# Altium schematic sheet SDVX.SchDoc
size A4; SheetNumber: 1; SheetTotal: 1
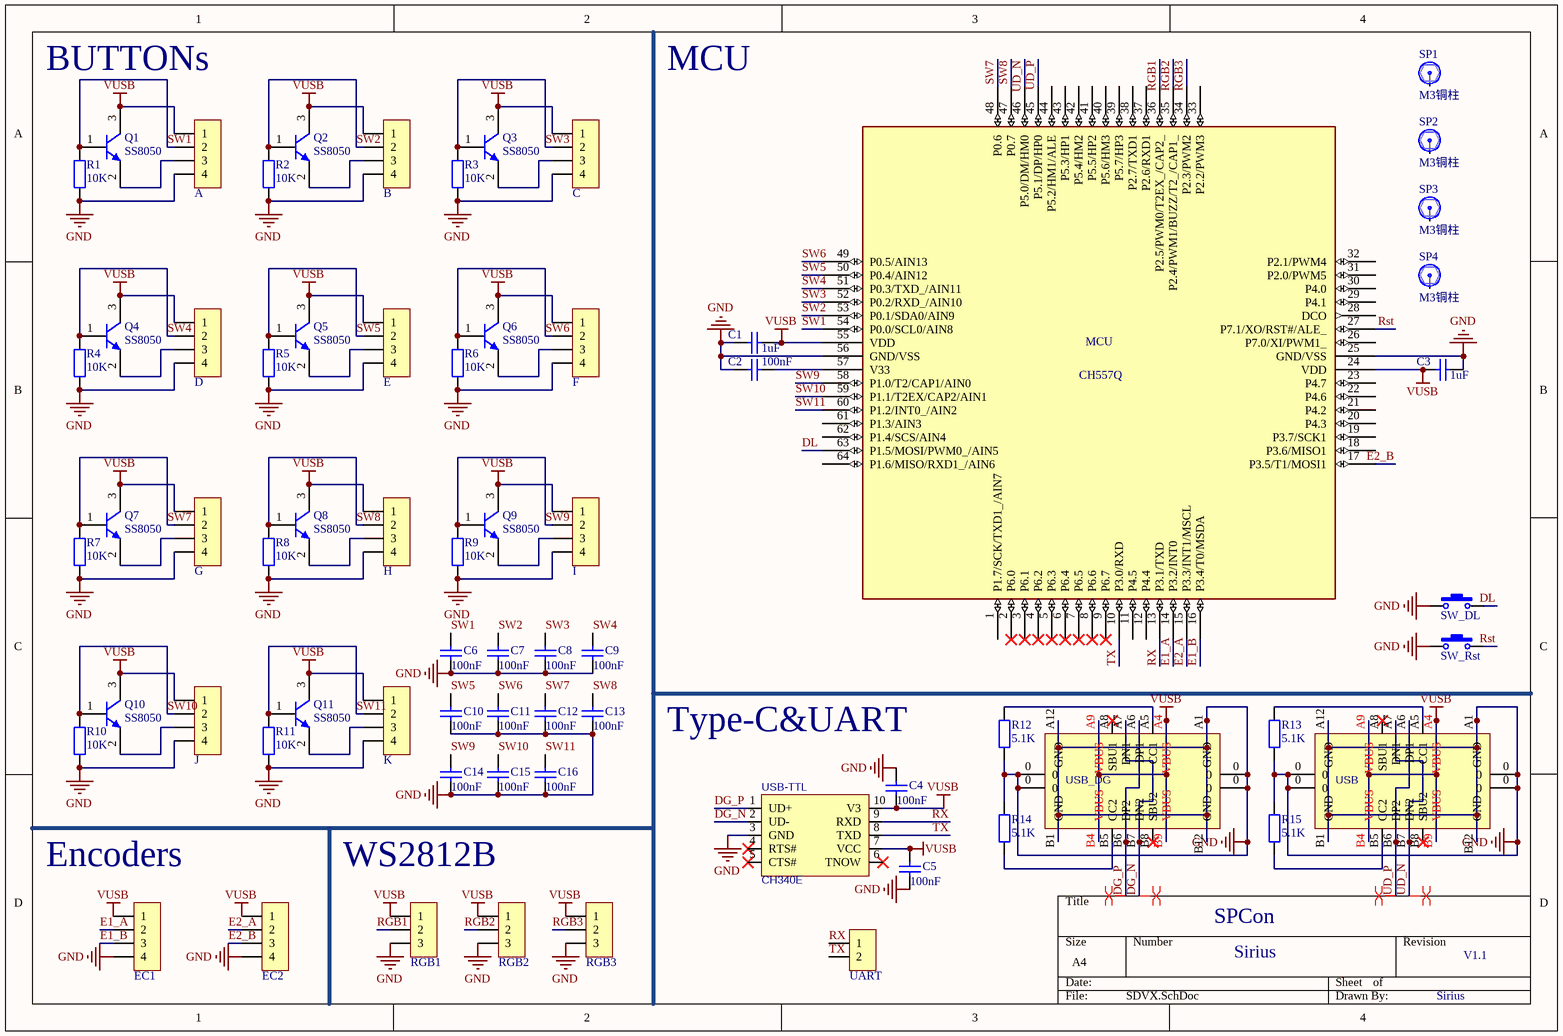
[diagram p0: SDVX.SchDoc]

## Parts
A  HDR-1X4  [XH2.54-WI-4P]  (value not drawn)
B  HDR-1X4  [XH2.54-WI-4P]  (value not drawn)
C  HDR-1X4  [XH2.54-WI-4P]  (value not drawn)
C1  1uF  [C0603_L]
C2  100nF  [C0603_L]
C3  1uF  [C0603_L]
C4  100nF  [C0603_L]
C5  100nF  [C0603_L]
C6  100nF  [C0603_L]
C7  100nF  [C0603_L]
C8  100nF  [C0603_L]
C9  100nF  [C0603_L]
C10  100nF  [C0603_L]
C11  100nF  [C0603_L]
C12  100nF  [C0603_L]
C13  100nF  [C0603_L]
C14  100nF  [C0603_L]
C15  100nF  [C0603_L]
C16  100nF  [C0603_L]
D  HDR-1X4  [XH2.54-WI-4P]  (value not drawn)
E  HDR-1X4  [XH2.54-WI-4P]  (value not drawn)
EC1  HDR-1X4  [XH2.54-WI-4P]  (value not drawn)
EC2  HDR-1X4  [XH2.54-WI-4P]  (value not drawn)
F  HDR-1X4  [XH2.54-WI-4P]  (value not drawn)
G  HDR-1X4  [XH2.54-WI-4P]  (value not drawn)
H  HDR-1X4  [XH2.54-WI-4P]  (value not drawn)
I  HDR-1X4  [XH2.54-WI-4P]  (value not drawn)
J  HDR-1X4  [XH2.54-WI-4P]  (value not drawn)
K  HDR-1X4  [XH2.54-WI-4P]  (value not drawn)
MCU  CH557Q  [LQFP64]
Q1  SS8050  [SOT23-3M]
Q2  SS8050  [SOT23-3M]
Q3  SS8050  [SOT23-3M]
Q4  SS8050  [SOT23-3M]
Q5  SS8050  [SOT23-3M]
Q6  SS8050  [SOT23-3M]
Q7  SS8050  [SOT23-3M]
Q8  SS8050  [SOT23-3M]
Q9  SS8050  [SOT23-3M]
Q10  SS8050  [SOT23-3M]
Q11  SS8050  [SOT23-3M]
R1  10K  [R0603_L]
R2  10K  [R0603_L]
R3  10K  [R0603_L]
R4  10K  [R0603_L]
R5  10K  [R0603_L]
R6  10K  [R0603_L]
R7  10K  [R0603_L]
R8  10K  [R0603_L]
R9  10K  [R0603_L]
R10  10K  [R0603_L]
R11  10K  [R0603_L]
R12  5.1K  [R0603_L]
R13  5.1K  [R0603_L]
R14  5.1K  [R0603_L]
R15  5.1K  [R0603_L]
RGB1  HDR-1X3  [HDR2.54-LI-3P]  (value not drawn)
RGB2  HDR-1X3  [HDR2.54-LI-3P]  (value not drawn)
RGB3  HDR-1X3  [HDR2.54-LI-3P]  (value not drawn)
SP1  M3铜柱  [M3x4_L]
SP2  M3铜柱  [M3x4_L]
SP3  M3铜柱  [M3x4_L]
SP4  M3铜柱  [M3x4_L]
SW_DL  3x6x5  [SW-SMD_L4.7-W3.5-P3.35-EH]  (value not drawn)
SW_Rst  3x6x5  [SW-SMD_L4.7-W3.5-P3.35-EH]  (value not drawn)
UART  HDR-1X2  [HDR2.54-LI-2P]  (value not drawn)
USB  TYPE-C 2.0 -16P  [USB-C-SMD_16P]  (value not drawn)
USB-TTL  CH340E  [MSOP-10]
USB_DG  TYPE-C 2.0 -16P  [USB-C-SMD_16P]  (value not drawn)

## Nets
GND: A.4 B.4 C.4 C1.2 C2.2 C3.1 C4.2 C5.1 C6.1 C7.1 C8.1 C9.1 C10.1 C11.1 C12.1 C13.1 C14.1 C15.1 C16.2 D.4 E.4 EC1.4 EC2.4 F.4 G.4 H.4 I.4 J.4 K.4 MCU.25(GND/VSS) MCU.56(GND/VSS) R1.1 R2.1 R3.1 R4.1 R5.1 R6.1 R7.1 R8.1 R9.1 R10.1 R11.1 R12.1 R13.1 R14.2 R15.2 RGB1.3 RGB2.3 RGB3.3 SW_DL.1 SW_Rst.1 USB.0 USB.A1(GND) USB.A12(GND) USB.B1(GND) USB.B12(GND) USB-TTL.3(GND) USB_DG.0 USB_DG.A1(GND) USB_DG.A12(GND) USB_DG.B1(GND) USB_DG.B12(GND)
VUSB: A.1 B.1 C.1 C1.1 C3.2 C4.1 C5.2 D.1 E.1 EC1.1 EC2.1 F.1 G.1 H.1 I.1 J.1 K.1 MCU.24(VDD) MCU.55(VDD) Q1.3(C) Q2.3(C) Q3.3(C) Q4.3(C) Q5.3(C) Q6.3(C) Q7.3(C) Q8.3(C) Q9.3(C) Q10.3(C) Q11.3(C) RGB1.1 RGB2.1 RGB3.1 USB.A4(VBUS) USB.A9(VBUS) USB.B4(VBUS) USB.B9(VBUS) USB-TTL.7(VCC) USB-TTL.10(V3) USB_DG.A4(VBUS) USB_DG.A9(VBUS) USB_DG.B4(VBUS) USB_DG.B9(VBUS)
DG_N: USB-TTL.2(UD-) USB_DG.A7(DN1) USB_DG.B7(DN2)
DG_P: USB-TTL.1(UD+) USB_DG.A6(DP1) USB_DG.B6(DP2)
DL: MCU.63(P1.5/MOSI/PWM0_/AIN5) SW_DL.2
E1_A: EC1.2 MCU.14(P3.2/INT0)
E1_B: EC1.3 MCU.16(P3.4/T0/MSDA)
E2_A: EC2.2 MCU.15(P3.3/INT1/MSCL)
E2_B: EC2.3 MCU.17(P3.5/T1/MOSI1)
RGB1: MCU.36(P2.5/PWM0/T2EX_/CAP2_) RGB1.2
RGB2: MCU.35(P2.4/PWM1/BUZZ/T2_/CAP1_) RGB2.2
RGB3: MCU.34(P2.3/PWM2) RGB3.2
Rst: MCU.27(P7.1/XO/RST#/ALE_) SW_Rst.2
RX: MCU.13(P3.1/TXD) UART.1 USB-TTL.9(RXD)
SW1: A.2 C6.2 MCU.54(P0.0/SCL0/AIN8) Q1.1(B) R1.2
SW2: B.2 C7.2 MCU.53(P0.1/SDA0/AIN9) Q2.1(B) R2.2
SW3: C.2 C8.2 MCU.52(P0.2/RXD_/AIN10) Q3.1(B) R3.2
SW4: C9.2 D.2 MCU.51(P0.3/TXD_/AIN11) Q4.1(B) R4.2
SW5: C10.2 E.2 MCU.50(P0.4/AIN12) Q5.1(B) R5.2
SW6: C11.2 F.2 MCU.49(P0.5/AIN13) Q6.1(B) R6.2
SW7: C12.2 G.2 MCU.48(P0.6) Q7.1(B) R7.2
SW8: C13.2 H.2 MCU.47(P0.7) Q8.1(B) R8.2
SW9: C14.2 I.2 MCU.58(P1.0/T2/CAP1/AIN0) Q9.1(B) R9.2
SW10: C15.2 J.2 MCU.59(P1.1/T2EX/CAP2/AIN1) Q10.1(B) R10.2
SW11: C16.1 K.2 MCU.60(P1.2/INT0_/AIN2) Q11.1(B) R11.2
TX: MCU.10(P3.0/RXD) UART.2 USB-TTL.8(TXD)
UD_N: MCU.46(P5.0/DM/HM0) USB.A7(DN1) USB.B7(DN2)
UD_P: MCU.45(P5.1/DP/HP0) USB.A6(DP1) USB.B6(DP2)
NetA_3: A.3 Q1.2(E)
NetB_3: B.3 Q2.2(E)
NetC2_1: C2.1 MCU.57(V33)
NetC_3: C.3 Q3.2(E)
NetD_3: D.3 Q4.2(E)
NetE_3: E.3 Q5.2(E)
NetF_3: F.3 Q6.2(E)
NetG_3: G.3 Q7.2(E)
NetH_3: H.3 Q8.2(E)
NetI_3: I.3 Q9.2(E)
NetJ_3: J.3 Q10.2(E)
NetK_3: K.3 Q11.2(E)
NetR12_2: R12.2 USB_DG.A5(CC1)
NetR13_2: R13.2 USB.A5(CC1)
NetR14_1: R14.1 USB_DG.B5(CC2)
NetR15_1: R15.1 USB.B5(CC2)

Not connected (* = marked no-connect by the designer): MCU 1(P1.7/SCK/TXD1_/AIN7) 2(P6.0)* 3(P6.1)* 4(P6.2)* 5(P6.3)* 6(P6.4)* 7(P6.5)* 8(P6.6)* 9(P6.7)* 11(P4.5) 12(P4.4) 18(P3.6/MISO1) 19(P3.7/SCK1) 20(P4.3) 21(P4.2) 22(P4.6) 23(P4.7) 26(P7.0/XI/PWM1_) 28(DCO) 29(P4.1) 30(P4.0) 31(P2.0/PWM5) 32(P2.1/PWM4) 33(P2.2/PWM3) 37(P2.6/RXD1) 38(P2.7/TXD1) 39(P5.7/HP3) 40(P5.6/HM3) 41(P5.5/HP2) 42(P5.4/HM2) 43(P5.3/HP1) 44(P5.2/HM1/ALE) 61(P1.3/AIN3) 62(P1.4/SCS/AIN4) 64(P1.6/MISO/RXD1_/AIN6); SP1 1; SP2 1; SP3 1; SP4 1; USB A8(SBU1)* B8(SBU2)*; USB-TTL 4(RTS#)* 5(CTS#)* 6(TNOW)*; USB_DG A8(SBU1)* B8(SBU2)*

## Layout directives
differential pair: DG_N, DG_P, UD_N, UD_P

## Notes on the sheet
- BUTTONs
- MCU
- Type-C&UART
- (near EC1) Encoders
- WS2812B
- SPCon
- Sirius
- V1.1

## Library data of the parts
A B C D E EC1 EC2 F G H I J K = Header 4: 4P接插件; 封装库来自淘宝卖家 ID：黄晶宝石: 其他店铺购入均为盗版假冒封装库; 联系卖家，免费查找封装: 唯一出售店铺网址https://shop463601444.taobao.com; BOM名称: 4P接插件
C1-C16 = C: 贴片电容; BOM名称: 无极性贴片电容; 联系卖家，免费查找封装: 唯一出售店铺网址https://shop463601444.taobao.com; 封装库来自淘宝卖家ID：黄晶宝石: 其他店铺购入均为盗版假冒封装库，请立即申请退款
MCU = CH557Q: 8bit MCS51 MCU with ADC & USB host 4 ports & USB device & RGB PWM & dual UART & SPI & I2C
Q1-Q11 = BCP68: NPN三极管; 联系卖家，免费查找封装: 唯一出售店铺网址https://shop463601444.taobao.com
R1-R15 = R: 贴片电阻; 联系卖家，免费查找封装: 唯一出售店铺网址https://shop463601444.taobao.com; BOM名称: 贴片电阻
RGB1-RGB3 = Header 3: 3P接插件; 封装库来自淘宝卖家 ID：黄晶宝石: 其他店铺购入均为盗版假冒封装库; 联系卖家，免费查找封装: 唯一出售店铺网址https://shop463601444.taobao.com; BOM名称: 3P接插件
SP1-SP4 = 铜柱小焊盘: 铜柱; 联系卖家，免费查找封装: 唯一出售店铺网址https://shop463601444.taobao.com; 封装库来自淘宝卖家ID：黄晶宝石: 其他店铺购入均为盗版假冒封装库，请立即申请退款; BOM名称: 铜柱
SW_DL SW_Rst = SW: 轻触开关; BOM名称: 3x6轻触开关; 联系卖家，免费查找封装: 唯一出售店铺网址https://shop463601444.taobao.com; 封装库来自淘宝卖家ID：黄晶宝石: 其他店铺购入均为盗版假冒封装库，请立即申请退款
UART = Header 2: 2P接插件; 封装库来自淘宝卖家 ID：黄晶宝石: 其他店铺购入均为盗版假冒封装库; 联系卖家，免费查找封装: 唯一出售店铺网址https://shop463601444.taobao.com; BOM名称: 2P接插件
USB USB_DG = USB2.0_Type-C_16Pin: USB2.0 Type-C 16Pin  母座; 联系卖家，免费技术支持: 唯一出售店铺网址https://shop463601444.taobao.com
USB-TTL = CH340E: USB转串口芯片，内置时钟; 联系卖家，免费查找封装: 唯一出售店铺网址https://shop463601444.taobao.com